# Altium schematic sheet Main_Board.SchDoc (part 3 of 3)
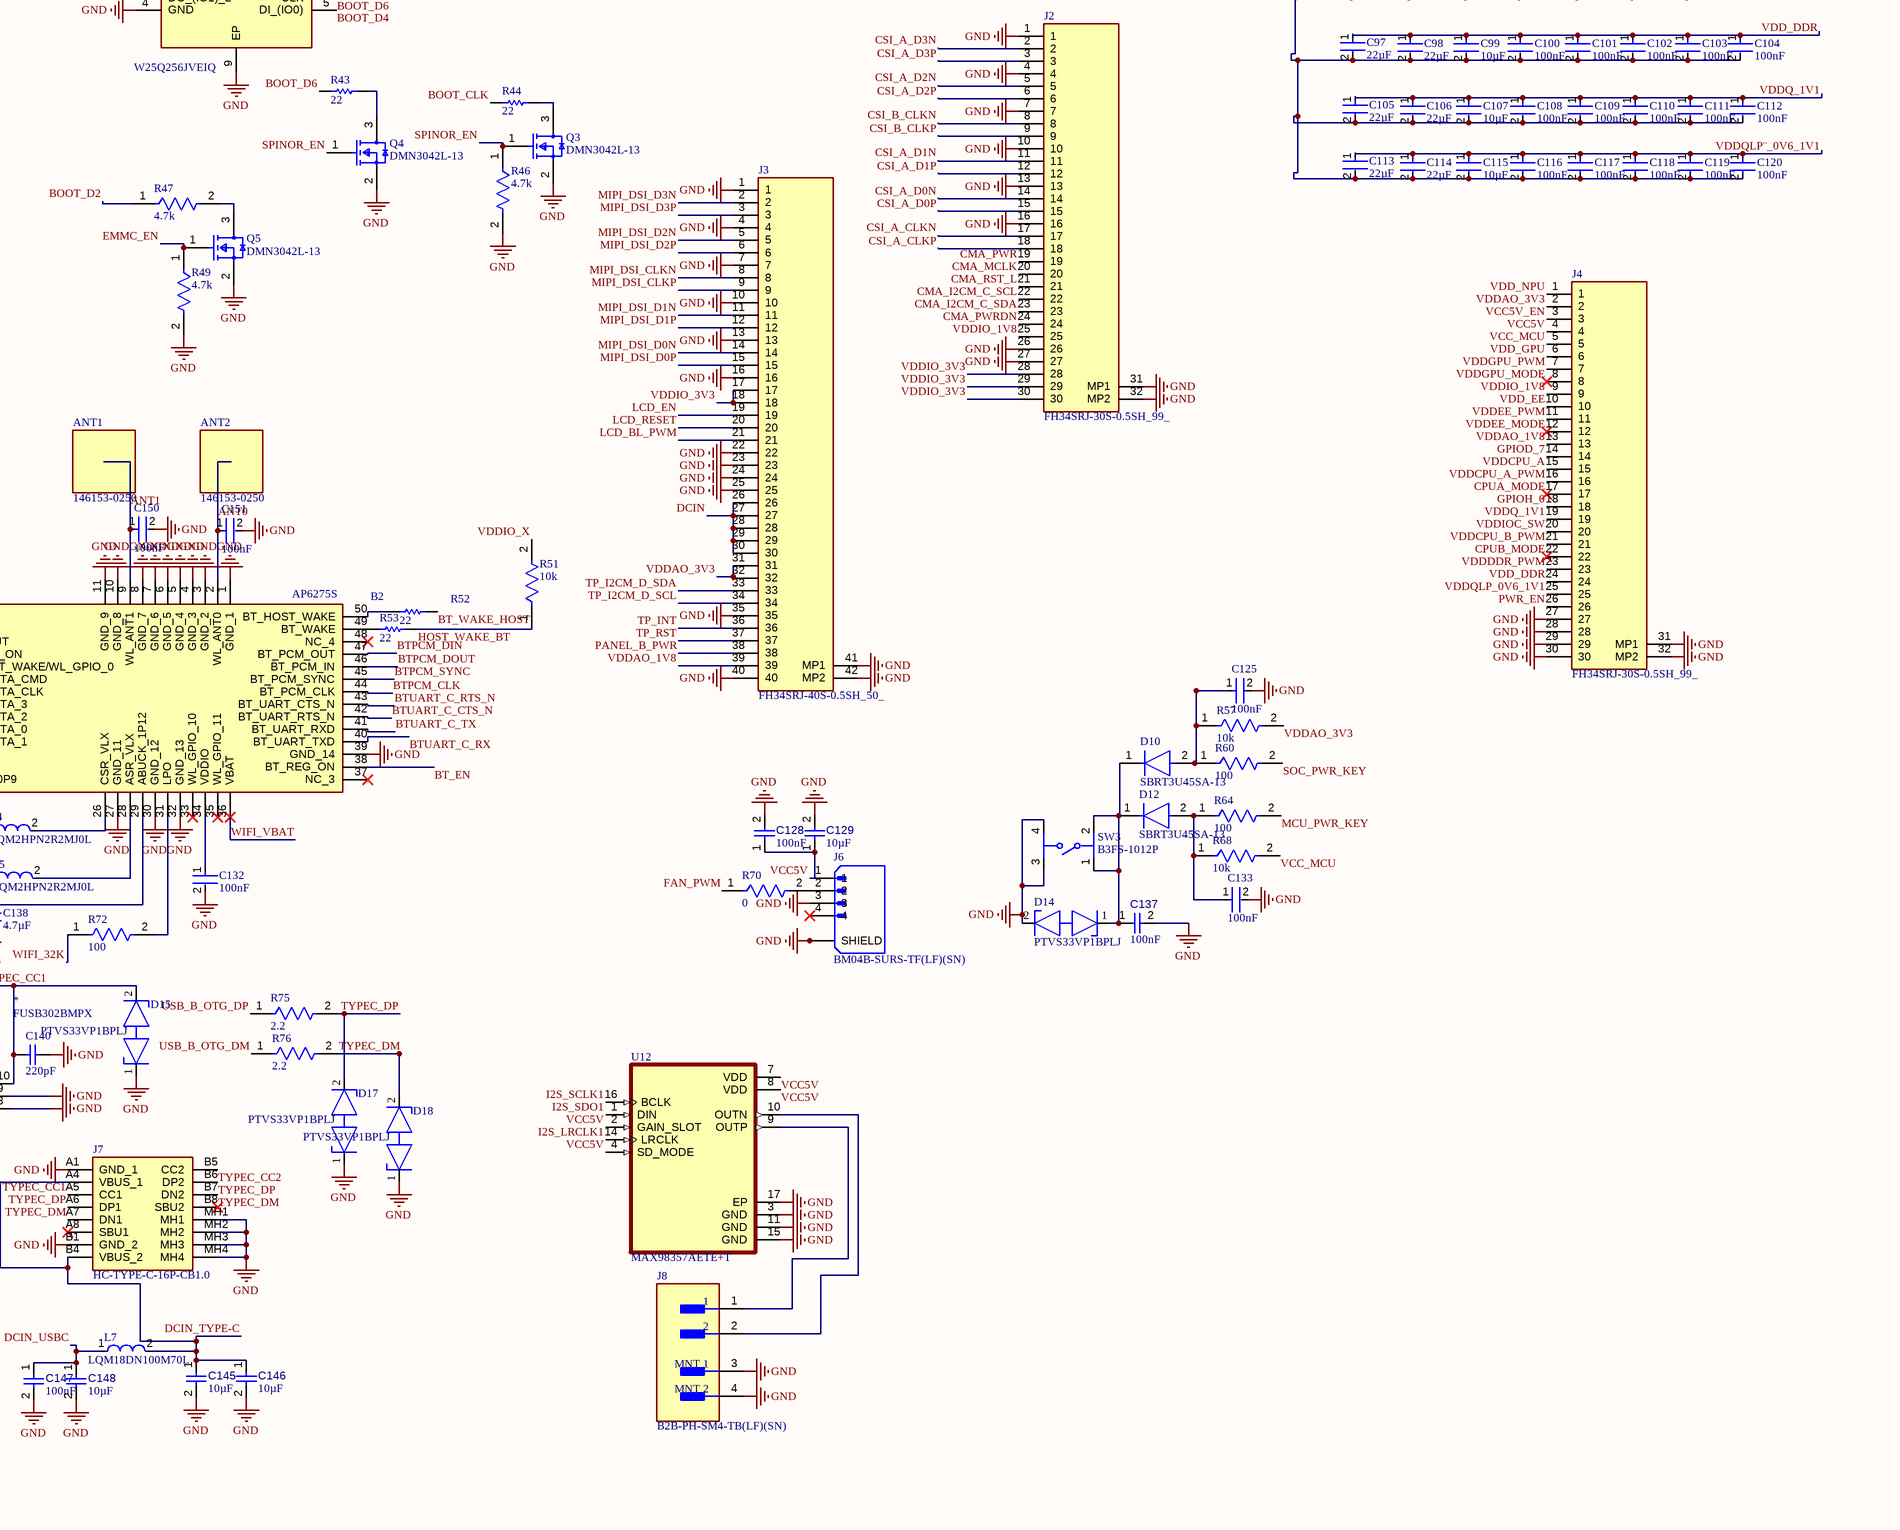
[diagram p7: Main_Board.SchDoc, bottom right]

## Library data of the parts
* = CMP-019-00062-1: Full Speed Programmable USB Power Delivery Controller USB 3.1 3.3V T/R 14-Pin WQFN EP; Min Supply Voltage: 2.7V; Max Supply Voltage: 5.5V; Mounting Technology: Surface Mount; Max Operating Temperature: 85°C; Min Operating Temperature: -40°C
ANT1 ANT2 = CMP-04721-000005-1: RF ANT 2.4/5GHZ FLAT PATCH 250MM; Manufacturer: Molex; Gain: 2.4/3.2dB; Impedance: 50Ω; Number Of Bands: 2; Power Rating: 2W; Max Frequency: 5.85GHz; Return Loss: -10dB; RoHS: TRUE; Device Class L2: RF Semiconductors and Devices; Temperature: -30°C to +85°C; Temperature Range High: +85°C; Footprint Url: https://www.molex.com/pdm_docs/sd/1461530250_sd.pdf; Automotive: No; Temperature Range Low: -30°C; Digikey Description: RF ANT 2.4/5GHZ FLAT PATCH 250MM; Device Class L3: RF Antennas; Package: 0; ComponentLink2Description: Datasheet; Lead Free: Yes; Octopart: https://octopart.com/146153-0250-molex-65153393; Manufacturer Part Number: 146153-0250; Device Class L1: Integrated Circuits (ICs); Category: Ant; ComponentLink2URL: https://www.molex.com/pdm_docs/ps/PS-146153-100-001.pdf
B1 = CMP-043-000000-2: 256M-bit Serial Flash Memory with uniform 4KB sectors and Dual/Quad SPI; Manufacturer_Name: Winbond; Geometry.Height: 0.8mm; Mouser Price/Stock: https://www.mouser.co.uk/ProductDetail/Winbond/W25Q256JVEIQ?qs=qSfuJ%252Bfl%2Fd4o%2FNFUf7yCgA%3D%3D; Arrow Price/Stock: https://www.arrow.com/en/products/w25q256jveiq/winbond-electronics.html?utm_currency=USD&region=nac; Source: W25Q256JVEIQ.SchLib; Datasheet Link: https://www.winbond.com/hq/search-resource-file.jsp?partNo=W25Q256JVEIQ&type=datasheet; Design Item ID: W25Q256JVEIQ; Mouser Part Number: 454-W25Q256JVEIQ; Manufacturer_Part_Number: W25Q256JVEIQ; Arrow Part Number: W25Q256JVEIQ
B2 = CMP-052-000000-2: IEEE 802.11ax/ac/a/b/g/n 2x2 WiFi with Bluetooth5.0 Combo Sip Module; Manufacturer_Name: SparkLAN; Geometry.Height: 1.55mm; Arrow Price/Stock: *; Mouser Price/Stock: *; Manufacturer_Part_Number: AP6275S; Source: AP6275S.SchLib; Arrow Part Number: *; Mouser Part Number: *; Datasheet Link: https://www.mev-elektronik.com/files/MEV%20Elektronik%20Service/produkt-downloads/rf-microwave-wireless/download_AP6275S_datasheet_ver1.0_20191129%20(1).pdf; Design Item ID: AP6275S
C1 C128 C137 = CMP-001-00067-3: Chip Capacitor, 100nF +/-20%, 50V, 0402, Thickness 0.6 mm; Tolerance: 10%; Min Operating Temperature: -55°C; Pins: 2; Case/Package: 0402; Max Operating Temperature: 85°C; Voltage Rating: 50V; Mounting Technology: SMT
C2 = CMP-001-00066-3: Chip Capacitor, 1nF +/-20%, 50V, 0402, Thickness 0.33 mm; Tolerance: 10%; Case/Package: 0402; Pins: 2; Min Operating Temperature: -55°C; Max Operating Temperature: 85°C; Voltage Rating: 50V; Mounting Technology: SMT
C3 = CMP-001-00103-1: Cap Ceramic 0.0047uF 10V X5R 10% Pad SMD 0201 85C Automotive T/R; Voltage Rating: 10V; Max Operating Temperature: 85°C; Tolerance: 10%; Case/Package: 0201; Mounting Technology: Surface Mount; Min Operating Temperature: -55°C
C4 = CMP-001-00105-1: 10V 1uF X5R ±20% 0201 Multilayer Ceramic Capacitors MLCC - SMD/SMT ROHS; Min Operating Temperature: -55°C; Max Operating Temperature: 85°C; Case/Package: 0201; Tolerance: 20%; Mounting Technology: Surface Mount
C5 C13 = CMP-001-00061-3: Chip Capacitor, 100nF +/-20%, 10V, 0402, Thickness 0.6 mm; Tolerance: 20%; Mounting Technology: SMT; Voltage Rating: 10V; Max Operating Temperature: 85°C; Pins: 2; Case/Package: 0402; Min Operating Temperature: -55°C
C6 = CMP-001-00106-1: 50V 10pF C0G ±1% 0201 Multilayer Ceramic Capacitors MLCC - SMD/SMT ROHS; Min Operating Temperature: -55°C; Max Operating Temperature: 125°C; Mounting Technology: Surface Mount; Case/Package: 0201; Voltage Rating: 50V; Tolerance: 1%
C7 C8 = CMP-001-00063-3: Chip Capacitor, 1µF +/-20%, 10V, 0402, Thickness 0.6 mm; Tolerance: 10%; Mounting Technology: SMT; Max Operating Temperature: 85°C; Voltage Rating: 10V; Pins: 2; Case/Package: 0402; Min Operating Temperature: -55°C
C9 = CMP-001-00104-1: 0201 (0603METRIC) Ceramic Capacitor SMD Comm C0G 25V 15PF ±5% C0G NP0; Mounting Technology: Surface Mount; Voltage Rating: 25V; Max Operating Temperature: 125°C; Tolerance: 5%; Case/Package: 0201; Min Operating Temperature: -55°C
C10 = CMP-001-00108-1: 10V 2.2uF X5R ±20% 0201 Multilayer Ceramic Capacitors MLCC - SMD/SMT ROHS; Case/Package: 0201; Max Operating Temperature: 85°C; Min Operating Temperature: -55°C; Mounting Technology: Surface Mount; Voltage Rating: 10V
C11 C12 C130 C138 = CMP-001-00107-1: 0201 4.7 uF 6.3 V ±10 % Tolerance X5R SMT Multilayer Ceramic Chip Capacitor; Tolerance: 20%; Voltage Rating: 6.3V; Case/Package: 0201; Min Operating Temperature: -55°C; Mounting Technology: Surface Mount; Max Operating Temperature: 85°C
C14 C15 = CMP-001-00114-1: CAP CER 12PF 50V C0G/NP0 0201 / 12 pF ±1% 50V Ceramic Capacitor C0G, NP0 0201 (0603 Metric); Tolerance: 1%; Min Operating Temperature: -55°C; Max Operating Temperature: 125°C; Voltage Rating: 50V; Mounting Technology: Surface Mount; Case/Package: 0201
C16 C26 C34 C35 C42 C57 C65 C73 C83 C91 C99 C107 C115 C124 = CMP-001-00109-1: CAP CER 10UF 4V X5R 0402 / 10 µF ±20% 4V Ceramic Capacitor X5R 0402 (1005 Metric); Min Operating Temperature: -55°C; Voltage Rating: 4V; Max Operating Temperature: 85°C; Tolerance: 20%; Case/Package: 0402; Mounting Technology: Surface Mount
C17 C18 C32 C33 C37 C44-C46 C80 C131 = CMP-001-00111-1: 10V 1uF X5R ±20% 0201 Multilayer Ceramic Capacitors MLCC - SMD/SMT ROHS; Min Operating Temperature: -55°C; Case/Package: 0201; Tolerance: 20%; Mounting Technology: Surface Mount; Max Operating Temperature: 85°C
C19 C20 C23 C27-C31 C38-C40 C47-C54 C58-C62 C66-C70 C74-C79 C84-C88 C92-C96 C100-C104 C108-C112 C116-C120 C122 C123 C125 C132 C133 C142 C144 C149-C151 = CMP-001-00112-1: 16V 100nF X5R ±10% 0201 Multilayer Ceramic Capacitors MLCC - SMD/SMT ROHS; Max Operating Temperature: 85°C; Min Operating Temperature: -55°C; Mounting Technology: Surface Mount; Voltage Rating: 16V; Case/Package: 0201; Tolerance: 10%
C21 C22 C36 C43 = CMP-001-00110-1: 6.3V 4.7uF X5R ±20% 0402 Multilayer Ceramic Capacitors MLCC - SMD/SMT ROHS; Tolerance: 20%; Voltage Rating: 6.3V; Mounting Technology: Surface Mount; Case/Package: 0402; Max Operating Temperature: 85°C; Min Operating Temperature: -55°C
C24 C25 C41 C55 C56 C63 C64 C71 C72 C81 C82 C89 C90 C97 C98 C105 C106 C113 C114 = CMP-001-00097-1: 6.3V 22uF X5R ±20% 0603 Multilayer Ceramic Capacitors MLCC - SMD/SMT ROHS; Mounting Technology: Surface Mount; Tolerance: 20%; Max Operating Temperature: 85°C; Case/Package: 0603; Voltage Rating: 6.3V; Min Operating Temperature: -55°C
C121 = CMP-001-00115-1: 10V 2.2uF X5R ±20% 0201 Multilayer Ceramic Capacitors MLCC - SMD/SMT ROHS; Voltage Rating: 10V; Mounting Technology: Surface Mount; Max Operating Temperature: 85°C; Min Operating Temperature: -55°C; Case/Package: 0201
C126 C127 = CMP-001-00102-1: 25V 22pF C0G ±1% 0201 Multilayer Ceramic Capacitors MLCC - SMD/SMT ROHS; Case/Package: 0201; Mounting Technology: Surface Mount; Tolerance: 1%; Min Operating Temperature: -55°C; Max Operating Temperature: 125°C; Voltage Rating: 25V
C129 C141 C143 = CMP-001-00074-3: Chip Capacitor, 10µF +/-40%, 6.3V, 0402, Thickness 0.6 mm; Tolerance: 10%; Case/Package: 0402; Pins: 2; Mounting Technology: SMT; Voltage Rating: 6.3V; Max Operating Temperature: 85°C; Min Operating Temperature: -55°C
C134-C136 C145 C146 C148 = CMP-001-00075-4: Chip Capacitor, 10µF +/-20%, 10V, 0603, Thickness 1 mm; Tolerance: 10%; Voltage Rating: 10V; Max Operating Temperature: 85°C; Pins: 2; Case/Package: 0603; Mounting Technology: SMT; Min Operating Temperature: -55°C
C139 C140 = CMP-001-00116-1: 0201 220 pF 16 V ±10 % Tolerance X7R Surface Mount Multilayer Ceramic Capacitor; Voltage Rating: 16V; Tolerance: 10%; Case/Package: 0201; Pins: 2; Min Operating Temperature: -55°C; Max Operating Temperature: 125°C; Mounting Technology: Surface Mount
C147 = CMP-001-00001-6: Chip Capacitor, 0.1 uF, +/- 5%, 16 V, 0402 (1005 Metric); Capacitor Type: Ceramic; Voltage Rating: 16V; Max Operating Temperature: 125°C; Min Operating Temperature: -55°C; Case/Package: 0402; Mounting Technology: SM; Pins: 2; Tolerance: 5%; RoHS Compliant: True
D1-D10 D12 = CMP-12791-000053-1: DIODE SBR 45V 3A SMA; Peak Reverse Current: 40mA; Element Configuration: Single; Forward Voltage: 420mV; Max Forward Surge Current (Ifsm): 50A; Min Operating Temperature: -55°C; Packaging: Tape and Reel; Max Reverse Voltage (DC): 45V; Package Quantity: 5000; Weight: 0.002258oz; Max Repetitive Reverse Voltage (Vrrm): 45V; Average Rectified Current: 3A; Mount: Surface Mount; Lead Free: Lead Free; Max Operating Temperature: 150°C; Case/Package: SMA
D11 D13-D18 = CMP-11424-155511901-1: 600 W Transient Voltage Suppressor
J1 = CMP-17439-000186-1: CONN HEADER SMD 2POS 0.8MM; Pitch: 0.031inch; Number of Positions: 2; Voltage Rating: 30V; Mated Stacking Heights: 3.95mm; Number of Rows: 1; Contact Material: Copper Alloy; Contact Shape: Rectangular; Packaging: Cut Tape; Lead Free: Lead Free; Fastening Type: Pull; Insulation Color: Natural; Series: SUR; Package Quantity: 2500; Termination: Solder; Color: Natural; Contact Type: Outer Shroud Contact; Contact Plating: Tin; Flammability Rating: UL94 V-0; Mount: Surface Mount; Connector Type: Header; Insulation Material: Nylon; Contact Finish - Mating: TIN
J2 J4 = CMP-002-00089-2: 30 Position FFC, FPC Connector Contacts, Top and Bottom 0.020" (0.50mm) Surface Mount, Right Angle -55C ~ 105C,50V,0.5A; Manufacturer_Part_Number: FH34SRJ-30S-0.5SH(99); Manufacturer_Name: Hirose; Connector Type: Receptacle; Gender: Female; Geometry.Height: 1.1mm; Mounting Technology: Surface Mount; Mouser Part Number: 798-FH34SRJ30S05SH99; Arrow Price/Stock: *; Mouser Price/Stock: https://www.mouser.co.uk/ProductDetail/Hirose-Connector/FH34SRJ-30S-0.5SH99?qs=%252BAZVS4b%2FkgI%2FlSMlYGcT5g%3D%3D; Source: FH34SRJ-30S-0.5SH_99_.SchLib; Max Operating Temperature: 105°C; Datasheet Link: https://www.hirose.com/product/download/?distributor=digikey&type=2d&lang=en&num=FH34SRJ-30S-0.5SH(99); Pins: 30; Min Operating Temperature: -55°C; Design Item ID: FH34SRJ-30S-0.5SH_99_; Voltage Rating: 50V; Arrow Part Number: *
J3 = CMP-002-00090-2: 40 Position FFC, FPC Connector Contacts, Top and Bottom 0.020" (0.50mm) Surface Mount, Right Angle; Manufacturer_Name: Hirose; Manufacturer_Part_Number: FH34SRJ-40S-0.5SH(50); Geometry.Height: 1.1mm; Design Item ID: FH34SRJ-40S-0.5SH_50_; Datasheet Link: https://www.hirose.com/en/product/document?clcode=CL0580-1260-6-50&productname=FH34SRJ-40S-0.5SH(50)&series=FH34SRJ&documenttype=2DDrawing&lang=en&documentid=0001483059; Arrow Part Number: *; Source: FH34SRJ-40S-0.5SH_50_.SchLib; Arrow Price/Stock: *; Mouser Price/Stock: https://www.mouser.co.uk/ProductDetail/Hirose-Connector/FH34SRJ-40S-0.5SH50?qs=iyLo5FA4poDa6AcLdJDWMw%3D%3D; Mouser Part Number: 798-FH34SRJ40S05SH50
J5 = CMP-002-00091-2: Molex PICO-EZMATE 78171, 1.2mm Pitch, 4 Way, 1 Row, Straight PCB Header, Surface Mount; Gender: Male; Voltage Rating: 50V; Geometry.Height: 1.6mm; Datasheet Link: https://www.molex.com/pdm_docs/sd/781710004_sd.pdf; Pins: 4; Arrow Price/Stock: *; Arrow Part Number: *; Mouser Part Number: 538-78171-0004; Manufacturer_Part_Number: 78171-0004; Min Operating Temperature: -25°C; Source: 78171-0004.SchLib; Design Item ID: 78171-0004; Mouser Price/Stock: https://www.mouser.co.uk/ProductDetail/Molex/78171-0004?qs=rg3U%2F5nEhHfTM3gyKulQEQ%3D%3D; Max Operating Temperature: 85°C; Manufacturer_Name: Molex
J6 = CMP-002-00094-1: Connector Header Surface Mount 4 position 0.031 (0.80mm); MF: JST Sales America Inc.; Design Item ID: BM04B-SURS-TF(LF)(SN); SnapEDA_Link: https://www.snapeda.com/parts/BM04B-SURS-TF(LF)(SN)/JST/view-part/?ref=snap; Check_prices: https://www.snapeda.com/parts/BM04B-SURS-TF(LF)(SN)/JST/view-part/?ref=eda; Pins: 6; Value: *; Source: BM04B-SURS-TF(LF)(SN).SchLib; Case/Package: None; Component Type: Standard; MP: BM04B-SURS-TF(LF)(SN)
J7 = CMP-061-000000-2: 3A 1 Sink panel 16P Female -25~+85 Type-C SMD USB Connectors ROHS; Manufacturer_Name: hanxia; Geometry.Height: 3.36mm; Manufacturer_Part_Number: HC-TYPE-C-16P-CB1.0; Source: HC-TYPE-C-16P-CB1.0.SchLib; Mouser Part Number: *; Mouser Price/Stock: *; Arrow Part Number: *; Arrow Price/Stock: *; Design Item ID: HC-TYPE-C-16P-CB1.0; Datasheet Link: https://www.lcsc.com/datasheet/lcsc_datasheet_2211161000_HCTL-HC-TYPE-C-16P-CB1-0_C2894901.pdf
J8 = CMP-2000-05163-2: CONN HEADER SMD 2POS 2MM; Number of Poles: 2; Max Current Rating: 2A; Gender: Male; Working Voltage: 100V; Mated Stacking Heights: 8.6mm; Contact Resistance: 20mR; Insulation Resistance: 1GR; Number of Contacts: 2; Housing Material: Polyamide; Lead Pitch: 2mm; Packaging: Tape and Reel; Fastening Type: Detent; Contact Finish - Mating: TIN; Width: 5.5mm; Min Operating Temperature: -25°C; Mount: Surface Mount; Current Rating: 2A; Pitch: 2mm; REACH SVHC: No SVHC; Flammability Rating: UL94 V-0; Contact Plating: Tin; Voltage Rating (AC): 100V; Length: 7.95mm; Number of Rows: 1; Max Operating Temperature: 85°C; Connector Type: Header; Height: 9.4mm; Insulation Material: Nylon; Depth: 5mm; Color: White; Termination: Solder; Housing Color: Beige; Contact Mating Length: 0.13inch; Contact Material: Copper Alloy; Orientation: Straight; Contact Type: Male Pin; Lead Free: Lead Free; Voltage Rating: 100V; Series: PH; Number of Positions: 2; Contact Shape: Square; Max Voltage Rating (AC): 100V; Insulation Color: Natural
L1 = CMP-06042-000419-1: Film type RF Inductor 110nH ±3% 80mA 12Ω 0201 (0603); Core Material: Non-Magnetic; Self Resonant Frequency: 800MHz; Shielding: Unshielded; Test Frequency: 300MHz; Q Factor: 8; DC Resistance (DCR): 12R; Length: 0.024inch; Case/Package: 0201; Case Code (Metric): 0603; Height: 0.3mm; Termination: SMD/SMT; Height - Seated (Max): 0.013inch; Min Operating Temperature: -55°C; Mount: Surface Mount; Package Quantity: 15000; Tolerance: 3%; Current Rating: 80mA; Packaging: Tape and Reel; Max DC Current: 80mA; Max Operating Temperature: 125°C; Resistor Type: Thin Film; Case Code (Imperial): 0201; Inductance: 110nH; Width: 0.012inch; Weight: 6E-06oz
L2 L3 = CMP-006-00026-1: Inductor Power Chip Shielded Multi-Layer 2.2uH 20% 1MHz Ferrite 1A 0.15Ohm DCR 1008 T/R; Self Resonant Frequency: 40MHz; Current Rating: 1A; Max Operating Temperature: 125°C; Min Operating Temperature: -55°C; Tolerance: 20%; Case/Package: 1008; Mounting Technology: Surface Mount; Max Current Rating: 1A
L4 L5 = CMP-06042-016476-1: Multilayer Type Inductor for Power Lines, 1008 (2520), 2.2μH, 20%, 0.15Ω, 1000mA; Inductance: 2.2uH; Current Rating: 1A; Self Resonant Frequency: 40MHz; Test Frequency: 1MHz; Shielding: Shielded; Core Material: Ferrite; Current: 140mA; DC Resistance (DCR): 120mR; Tolerance: 20%; Case Code (Metric): 2520; Inductance Tolerance: 20%; Length: 2.5mm; Depth: 2.2mm; Max Operating Temperature: 125°C; Min Operating Temperature: -55°C; REACH SVHC: No SVHC; Package Quantity: 1; Width: 2mm; Lead Free: Lead Free; Military Standard: Not; Mount: Surface Mount; Packaging: Tape and Reel; Radiation Hardening: No; Series: LQM2HP_J0; Termination: SMD/SMT; Max DC Current: 1A; Case/Package: 1008; Height: 1.1mm; Rated Current-Max: 1A; DC Current: 1A; Case Code (Imperial): 1008
L6 = CMP-006-00027-1: General Purpose Inductor, 10uH, 20%, 1 Element, Ferrite-Core, Reflow soldering, , 1608/0603; Max Current Rating: 300mA; Current Rating: 100mA; Self Resonant Frequency: 32MHz; Case/Package: 0603; Tolerance: 20%; Min Operating Temperature: -55°C; Max Operating Temperature: 125°C
L7 = CMP-06042-017052-1: Multilayer type Inductor for Power Lines 10uH ±20% @1MHz, 300mA, Max DCR 1.365Ω, SRF 32MHz
Q1 Q2 = CMP-12801-000067-1: MOSFET N-CH 30V 5.8A SOT23; Manufacturer: Diodes; Turn Off Delay Time: 13.9ns; Max Junction Temp: +150°C; Standoff Height: 0.013mm; Typ Forward Diode Voltage: 0.7V; Threshold Vgs Min: 0.6V; Gate To Source Voltage: 12V; Number Of Channels: 1; Input Capacitace At Vds: 570pF @ 15V; Rthja Max: 171°C/W; Power Dissipation: 0.72W; Turn On Delay Time: 1.5ns; Pulse Drain Current: 30A; Reverse Recovery Time: 7.8ns; Max Forward Diode Voltage: 1.2V; Drain To Source Resistance: 21mΩ; Depletion Mode: False; Gate Charge At Vgs: 13.3nC @ 10V; Threshold Vgs Max: 1.4V; Reverse Recovery Charge: 1.9nC; Digikey Description: MOSFET N-CH 30V 5.8A SOT23; ComponentLink2Description: Datasheet; Octopart: https://octopart.com/dmn3042l-13-diodes+inc.-57605025; Continuous Drain Current: 5.8A; Temperature: -55°C to +150°C; Package: SOT23; Footprint Url: https://www.diodes.com/assets/Package-Files/SOT23.pdf; ComponentLink2URL: https://www.diodes.com/assets/Datasheets/DMN3042L.pdf; Drain To Source Breakdown Voltage: 30V; Device Class L2: Transistors; Device Class L1: Discrete Semiconductors; Lead Free: Yes; Automotive: No; Number Of N Channels: 1; RoHS: TRUE; Temperature Range High: +150°C; Drain To Source Voltage: 30V; Device Class L3: MOSFETs; Manufacturer Part Number: DMN3042L-13; Mouser Description: MOSFET 30V N-Ch Enh Mode 26.5mOhm 12Vgs 570pF; Height: 1.1mm; Category: Trans; Temperature Range Low: -55°C
Q3-Q6 = CMP-013-00042-1: 720mW(Ta) 12V 1.4V@ 250¦ÌA 20nC@ 10 V 1N 30V 26.5m¦¸@ 5.8A, 10V 5.8A 860pF@15V SOT-23-3; Case/Package: TO-236-3; Max Operating Temperature: 150°C; Min Operating Temperature: -55°C; Mounting Technology: Surface Mount
R1 R4 R60 R64 = CMP-009-00212-1: Res Thick Film 0201 100 Ohm 5% 0.05W(1/20W) ±200ppm/C Pad SMD Automotive T/R; Voltage Rating: 25V; Case/Package: 0201; Min Operating Temperature: -55°C; Tolerance: 5%; Mounting Technology: Surface Mount; Max Operating Temperature: 155°C
R2 = CMP-009-00206-1: Fixed Resistor, Metal Glaze/thick Film, 0.05W, 3.3ohm, 25V, 5% +/-Tol, 400ppm/Cel, Surface Mount, 0201; Tolerance: 5%; Max Operating Temperature: 155°C; Case/Package: 0201; Min Operating Temperature: -55°C; Voltage Rating: 25V; Mounting Technology: Surface Mount
R3 = CMP-009-00208-1: Res General Purpose Thick Film 0201 1k Ohm 1% 1/20W ±200ppm/°C Molded Paper T/R; Voltage Rating: 25V; Case/Package: 0201; Min Operating Temperature: -55°C; Max Operating Temperature: 125°C; Tolerance: 1%
R5 R21 R24 R31 R36 R62 R63 R70 R77-R79 = CMP-009-00230-1: Resistor Jumper Metal Plate 0201 0 Ohm Molded SMD Paper T/R; Case/Package: 0201; Max Operating Temperature: 155°C; Min Operating Temperature: -55°C; Mounting Technology: Surface Mount
R6 R43 R44 R52-R54 R56 = CMP-009-00226-1: Resistor Thick Film 0201 22 Ohm 5% 1/20W 200ppm/C Molded SMD Paper T/R; Voltage Rating: 30V; Pins: 2; Case/Package: 0201; Min Operating Temperature: -55°C; Mounting Technology: Surface Mount; Tolerance: 5%; Max Operating Temperature: 155°C
R11 = CMP-009-00232-1: Res Thick Film 0201 2.26K Ohm 1% 1/20W ±200ppm/°C Molded SMD SMD T/R; Voltage Rating: 25V; Min Operating Temperature: -55°C; Mounting Technology: Surface Mount; Max Operating Temperature: 125°C; Case/Package: 0201; Tolerance: 1%
R14 R15 R17 R27-R30 R32 R34 R37-R40 R42 R45 R48 R51 R57 R61 R68 = CMP-009-00210-1: Fixed Resistor, Thin Film, 0.05W, 10000ohm, 25V, 0.1% +/-Tol, 50ppm/Cel, Surface Mount, 0201; Max Operating Temperature: 125°C; Min Operating Temperature: -55°C; Case/Package: 0201; Mounting Technology: Surface Mount; Voltage Rating: 25V; Tolerance: 0.1%
R16 R18 R41 R46 R47 R49 = CMP-009-00207-1: Res Thick Film 0201 4.7K Ohm 5% 0.05W(1/20W) ±200ppm/C Pad SMD Automotive T/R; Voltage Rating: 25V; Case/Package: 0201; Tolerance: 5%; Mounting Technology: Surface Mount; Min Operating Temperature: -55°C; Max Operating Temperature: 155°C
R19 = CMP-009-00227-1: CRCW FIXED RESISTOR 0201 (0603Metric) Chip Resistor ±5% ±200ppm/C 56kOhm 0.05W 1/20W; Voltage Rating: 30V; Max Operating Temperature: 155°C; Mounting Technology: Surface Mount; Tolerance: 5%; Case/Package: 0201; Min Operating Temperature: -55°C
R20 R23 = CMP-009-00231-1: Res Thick Film 0201 2K Ohm 5% 0.05W(1/20W) ±200ppm/C Pad SMD Automotive T/R; Voltage Rating: 25V; Case/Package: 0201; Max Operating Temperature: 155°C; Mounting Technology: Surface Mount; Tolerance: 5%; Min Operating Temperature: -55°C
R22 R26 R33 R35 R72 = CMP-009-00229-1: Res Thick Film 0201 100 Ohm 5% 0.05W(1/20W) ±200ppm/C Pad SMD Automotive T/R; Voltage Rating: 25V; Mounting Technology: Surface Mount; Case/Package: 0201; Max Operating Temperature: 155°C; Min Operating Temperature: -55°C; Tolerance: 5%
R25 = CMP-009-00228-1: CRCW FIXED RESISTOR 0201 (0603Metric) Chip Resistor ±5% ±200ppm/C 39kOhm 0.05W 1/20W; Voltage Rating: 30V; Case/Package: 0201; Max Operating Temperature: 155°C; Mounting Technology: Surface Mount; Tolerance: 5%; Min Operating Temperature: -55°C
R50 R58 R59 = CMP-010-00030-1: Res Thick Film 0201 47K Ohm 5% 0.05W(1/20W) ±200ppm/C Pad SMD Automotive T/R; Min Operating Temperature: -55°C; Mounting Technology: Surface Mount; Max Operating Temperature: 155°C; Case/Package: 0201
R55 = CMP-009-00220-1: 50mW Thick Film Resistors ±1% ±200ppm/℃ 499Ω 0201 Chip Resistor - Surface Mount ROHS; Voltage Rating: 25V; Min Operating Temperature: -55°C; Max Operating Temperature: 155°C; Case/Package: 0201; Mounting Technology: Surface Mount; Tolerance: 1%
R65 R69 = CMP-009-00205-1: Res General Purpose Thick Film 0201 100k Ohm 1% 1/20W ±200ppm/°C Molded Paper T/R; Voltage Rating: 25V; Case/Package: 0201; Min Operating Temperature: -55°C; Max Operating Temperature: 155°C; Mounting Technology: Surface Mount; Tolerance: 1%
R66 = CMP-009-00235-1: Res Thick Film 0201 22K Ohm 5% 0.05W(1/20W) ±200ppm/C Pad SMD T/R; Voltage Rating: 30V; Max Operating Temperature: 155°C; Mounting Technology: Surface Mount; Case/Package: 0201; Min Operating Temperature: -55°C; Tolerance: 5%
R67 R71 R73 = CMP-009-00233-1: CRCW FIXED RESISTOR 0201 (0603Metric) Chip Resistor ±5% ±200ppm/C 5.1kOhm 0.05W 1/20W; Voltage Rating: 30V; Max Operating Temperature: 155°C; Case/Package: 0201; Mounting Technology: Surface Mount; Min Operating Temperature: -55°C; Tolerance: 5%
R74 = CMP-009-00234-1: Res Thick Film 0201 13K Ohm 5% 0.05W(1/20W) ±200ppm/C Pad SMD T/R; Voltage Rating: 25V; Case/Package: 0201; Mounting Technology: Surface Mount; Max Operating Temperature: 155°C; Tolerance: 5%; Min Operating Temperature: -55°C
R75 R76 = CMP-009-00236-1: Res Thick Film 0201 2.2 Ohm 5% 0.05W(1/20W) ±400ppm/C Pad SMD T/R Automotive AEC-Q200; Voltage Rating: 25V; Case/Package: 0201; Mounting Technology: Surface Mount; Max Operating Temperature: 155°C; Min Operating Temperature: -55°C; Tolerance: 5%
SW1 SW2 = CMP-05618-000002-1: SWITCH TACTILE SPST-NO 0.02A 15V; Manufacturer: Panasonic Electronic Components; Electromechanical Life: 1000000Cycles; Contact Current Rating: 20mA; Contact Resistance: 100mΩ; Operating Force: 1N; Height: 3.3mm; ComponentLink2URL: https://industrial.panasonic.com/ac/cdn/e/control/switch/light-touch/catalog/sw_lt_eng_6s_th.pdf; Category: Switch; Mouser Description: Switch Tactile ON OFF SPST Round Button J-Bend 0.02A 15VDC 1N SMD Embossed T/R; Mount: Surface Mount; Temperature: -40°C to +85°C; Throw Configuration: SPST-NO; Digikey Description: SWITCH TACTILE SPST-NO 0.02A 15V; Device Class L1: Electromechanical; ComponentLink2Description: Datasheet; Manufacturer Part Number: EVQ-Q2H03W; Device Class L3: Tactile Switches; RoHS: TRUE; Device Class L2: Switches; Temperature Range High: +85°C; Temperature Range Low: -40°C; Octopart: https://octopart.com/evq-q2h03w-panasonic-1368538; Voltage Rating Dc: 15V; Package: 0; Automotive: No; Lead Free: Yes
SW3 = CMP-08834-000024-1: SWITCH TACTILE SPST-NO 0.05A 24V; Actuator Length: 1.7mm; Operating Force: 1.47N; Actuator Type: Standard; Switch Function: Off-Mom; Switch Travel: 0.25mm; Mechanical Life: 300000Cycles; Max Current Rating: 50mA; Illumination Type: Non-Illuminated; Throw Configuration: SPST; Contact Resistance: 100mR; Actuator Color: Beige; Package Quantity: 1; Voltage Rating (DC): 24V; Series: B3FS; Max Voltage Rating (DC): 24V; Orientation: Straight; Termination: Gull Wing; Min Operating Temperature: -20°C; Case/Package: SMD/SMT; Weight: 0.2g; Max Operating Temperature: 70°C; RoHS Compliant: Yes; Depth: 8mm; Mount: Surface Mount; Current Rating: 50mA; Radiation Hardening: No; Length: 6.3mm; Contact Plating: Silver; Packaging: Tape and Reel; Electrical Life: 300000Cycles
SW4 = CMP-10038-000017-1: SWITCH SLIDE DP3T 300MA 6V; Actuator Type: Standard; Actuator Color: Black; Contact Resistance: 70mR; Actuator Material: Nylon; Switch Function: On-On-On; Electrical Life: 15000Cycles; Max Operating Temperature: 85°C; Min Operating Temperature: -20°C; Length: 13mm; Packaging: Tray; Package Quantity: 1; Contact Material: Copper Alloy; Housing Material: Nylon; Termination: PC Pins; Max Current Rating: 300mA; Max Voltage Rating (DC): 6V; Series: JS; Mount: Through Hole; Flammability Rating: UL94 V-2; Contact Plating: Silver; Radiation Hardening: No; Depth: 5.6mm; Contact Current Rating: 300mA; Orientation: Right Angle; Throw Configuration: DP3T
U1 = CMP-020-00029-1: he Amlogic A311D2 features four Cortex-A73 cores, four Cortex-A53 cores, and a more powerful Mali-G52 MP8 (8EE) GPU that supports OpenGL ES 3.2, Vulkan 1.1, and 0penCL 2.0 graphics programs; Frequency: 2GHz; RAM Size: 8-16GB; Max Supply Voltage: 105V; Min Supply Voltage: -70V; Clock Frequency: 24MHz; Max Operating Temperature: 105°C; Min Operating Temperature: -70°C; Case/Package: FCBGA
U2 = CMP-10083-000010-1: IC RTC CLK/CALENDAR I2C 8-SOIC; Manufacturer: NXP; Nominal Supply Current: 0.225-0.95uA; Interface: I2C,2-Wire; Min Supply Voltage: 1V; Frequency: 400kHz; Standoff Height: 0.1mm; Number Of Outputs: 1; Max Supply Voltage: 5.5V; Digikey Description: IC RTC CLK/CALENDAR I2C 8-SOIC; Height: 1.75mm; Temperature: -40°C to +85°C; Category: IC; Package: SOT96-1; Ambient Temperature Range High: +85°C; Octopart: https://octopart.com/pcf8563t%2F5%2C518-nxp+semiconductors-19647995; Footprint Url: https://www.nxp.com/docs/en/package-information/SOT96-1.pdf; ComponentLink2URL: https://www.nxp.com/docs/en/data-sheet/PCF8563.pdf; RoHS: TRUE; ComponentLink2Description: Datasheet; Lead Free: Yes; Temperature Range Low: -40°C; Ambient Temperature Range Low: -40°C; Manufacturer Part Number: PCF8563T/5,518; Device Class L3: Real Time Clocks; Temperature Range High: +85°C; Automotive: No; Device Class L2: Clock and Timing; Mouser Description: Real Time Clock Binary I2C 1-5V RTC IC; Device Class L1: Integrated Circuits (ICs)
U3 = CMP-031-00007-2: Mainstream Arm Cortex-M0+ MCU with 32 Kbytes of Flash memory, 8 Kbytes RAM, 64 MHz CPU, 2x USART, timers, ADC, comm. I/F, 1.7-3.6V; Manufacturer_Name: STMicroelectronics; Max Supply Voltage: 3.6V; Min Supply Voltage: 1.7V; Design Item ID: STM32G031K6U6; RefDes: RefDes; Type: Type; Manufacturer_Part_Number: STM32G031K6U6; Min Operating Temperature: -40°C; Copyright: Copyright (C) 2026 Ultra Librarian. All rights reserved.; Max Operating Temperature: 85°C; Source: STM32G031K6U6.SchLib
U4 = CMP-038-000000-3: IC DRAM 32GBIT 2133MHZ 200VFBGA; Manufacturer_Name: Micron; Manufacturer_Part_Number: MT53D1024M32D4DT-046 AIT:D; Max Supply Voltage: 1.17V; Geometry.Height: 0.95mm; Clock Frequency: 2.1367GHz; Min Supply Voltage: 1.06V; Mouser Price/Stock: https://www.mouser.com/Search/Refine.aspx?Keyword=340-343901-TRAY; Min Operating Temperature: -40°C; Design Item ID: MT53D1024M32D4DT-046_AIT_D; Source: MT53D1024M32D4DT-046_AIT_D.SchLib; Datasheet Link: https://www.arrow.com/en/products/mt53d1024m32d4dt-046aitd/micron-technology; Arrow Part Number: MT53D1024M32D4DT-046 AIT:D; Arrow Price/Stock: https://www.arrow.com/en/products/mt53d1024m32d4dt-046aitd/micron-technology; Mouser Part Number: 340-343901-TRAY; Max Operating Temperature: 95°C
U5 = CMP-040-000000-1: SAMSUNG eÂ·MMC is an embedded MMC solution designed in a BGA package form; SnapEDA_Link: https://www.snapeda.com/parts/KLMAG2GEND-B031/Samsung/view-part/?ref=snap; Component Type: Standard; Design Item ID: KLMAG2GEND-B031; MP: KLMAG2GEND-B031; Source: KLMAG2GEND-B031.SchLib; Package: Package; MF: Samsung; Pin Count: 33; Value: *; Check_prices: https://www.snapeda.com/parts/KLMAG2GEND-B031/Samsung/view-part/?ref=eda
U6 = CMP-0339-00011-3: IC OR CTRLR SRC SELECT 8SON; Output Current: 1.25A; Operating Supply Current: 55uA; Number of Inputs: 2; Max Input Voltage: 5.5V; Turn-On Delay Time: 1ms; Max Power Dissipation: 2.5W; Turn-Off Delay Time: 5ms; Min Input Voltage: 2.8V; On-State Resistance: 150mR; Number of Outputs: 1; Package Quantity: 3000; Current - Output 2: 1.25A; REACH SVHC: No SVHC; Case/Package: TSSOP; Weight: 0.000847oz; Max Output Current: 1.25A; Radiation Hardening: No; Number of Pins: 8; Max Operating Temperature: 85°C; Lead Free: Lead Free; Packaging: Tape and Reel; Operating Supply Voltage: 5.5V; Max Supply Current: 55uA; Min Operating Temperature: -40°C
U7 = CMP-04910-000009-1: PWR MGMT BATTERY MGMT; Manufacturer: Texas Instruments; Min Supply Voltage: 2.8V; Max Junction Temp: +125°C; Output Voltage: 22V; Output Current: 1.5-5.2A; Standoff Height: 0mm; Number Of Outputs: 1; Nominal Supply Current: 300uA; Device Class L2: Power Management ICs; Octopart: https://octopart.com/tps2121ruxr-texas+instruments-95511053; Mouser Description: 2.7-22V, 56m?, 4.5A, Priority Power MUX with Seamless Switchover 12-VQFN-HR -40 to 125; Lead Free: Yes; Digikey Description: PWR MGMT BATTERY MGMT; Manufacturer Part Number: TPS2121RUXR; Height: 1mm; Device Class L1: Integrated Circuits (ICs); Category: IC; Max Supply Voltage: 22V; ComponentLink2Description: Datasheet; Temperature: -40°C to +125°C; Temperature Range High: +125°C; ComponentLink2URL: https://www.ti.com/lit/ds/symlink/tps2121.pdf; Automotive: No; Package: RUX0012A; RoHS: TRUE; Device Class L3: unset; Temperature Range Low: -40°C
U8-U11 U13 U14 U17-U26 = CMP-067-000000-1: Intelligent control LED integrated light source; MP: WS2812B-B; Value: *; Pin Count: 4; Source: WS2812B-B.SchLib; Package: None; Price: None; Design Item ID: WS2812B-B; Component Type: Standard; Availability: Unavailable
U12 = CMP-014-00003-2: Tiny, Low-Cost, PCM Class D Amplifier with Class AB Performance; Max Supply Voltage: 5.5V; MF: Analog Devices; Min Supply Voltage: 2.5V; Check_prices: https://www.snapeda.com/parts/MAX98357AETE+T/Analog+Devices/view-part/?ref=eda; Min Operating Temperature: -40°C; Case/Package: TQFN-16 Maxim; Design Item ID: MAX98357AETE+T; MP: MAX98357AETE+T; Mounting Technology: Surface Mount; Value: *; Max Operating Temperature: 85°C; Component Type: Standard; Source: MAX98357AETE+T.SchLib; Pins: 16; SnapEDA_Link: https://www.snapeda.com/parts/MAX98357AETE+T/Analog+Devices/view-part/?ref=snap
U15 U16 = CMP-00196-121674314-1: IM67D120AXTSA1 MEMS Microphone Omni-Directional -26dB 1.62V to 3.6V 5-Pin LLGA-5-4 Solder Pad T/R; NexarPartId: 121674314
X1 = CMP-003-00019-2: Ceramic SMD Crystal, 24 MHz, +/- 20 ppm, 18 pF, -20 to 70 degC, 4-Pin SMD, RoHS, Tape and Reel; Manufacturer: Abracon; Load Capacitance: 18pF; Frequency Tolerance: 20ppm; ESR: 50; Resistance: 50Ohm; Frequency: 24MHz; Package Quantity: 1000; Packaging: TapeandReel; RoHS Compliant: True; Package Description: 4-Pin Surface Mount Device, Body 5 x 3.2 mm; Mounting Technology: SM; Pins: 4; Datasheet URL: http://www.abracon.com/Resonators/abm3b.pdf; Tolerance: 20ppm; Manufacturer URL: http://www.abracon.com/; Max Operating Temperature: 70°C; Datasheet Version: Aug-15; Min Operating Temperature: -20°C; Package Reference: ABM3B; Case/Package: CSMD
Y1 = CMP-27762-015939-1: Crystal 32.768kHz ±20ppm (Tol) 12.5pF FUND 90kΩ 2-Pin Mini-CSMD T/R; ESR (Equivalent Series Resistance): 90kR; Min Operating Temperature: -40°C; Frequency Tolerance: 20ppm; Load Capacitance: 12.5pF; Packaging: Cut Tape; Case/Package: SMD/SMT; Series: ABS06; Max Operating Temperature: 85°C; RoHS Compliant: Yes; Frequency: 32.768kHz; Mount: Surface Mount
Y2 = CMP-27762-010000-1: Crystal 37.4MHz ±10ppm 5pF SMD-4 1.2mm x 1mm; ESR (Equivalent Series Resistance): 50R; Frequency Stability: 50ppm; Case/Package: SMD/SMT; Min Operating Temperature: -40°C; Frequency: 37.4MHz; RoHS Compliant: Yes; Frequency Tolerance: 10ppm; Max Operating Temperature: 125°C; Load Capacitance: 5pF; Mount: Surface Mount